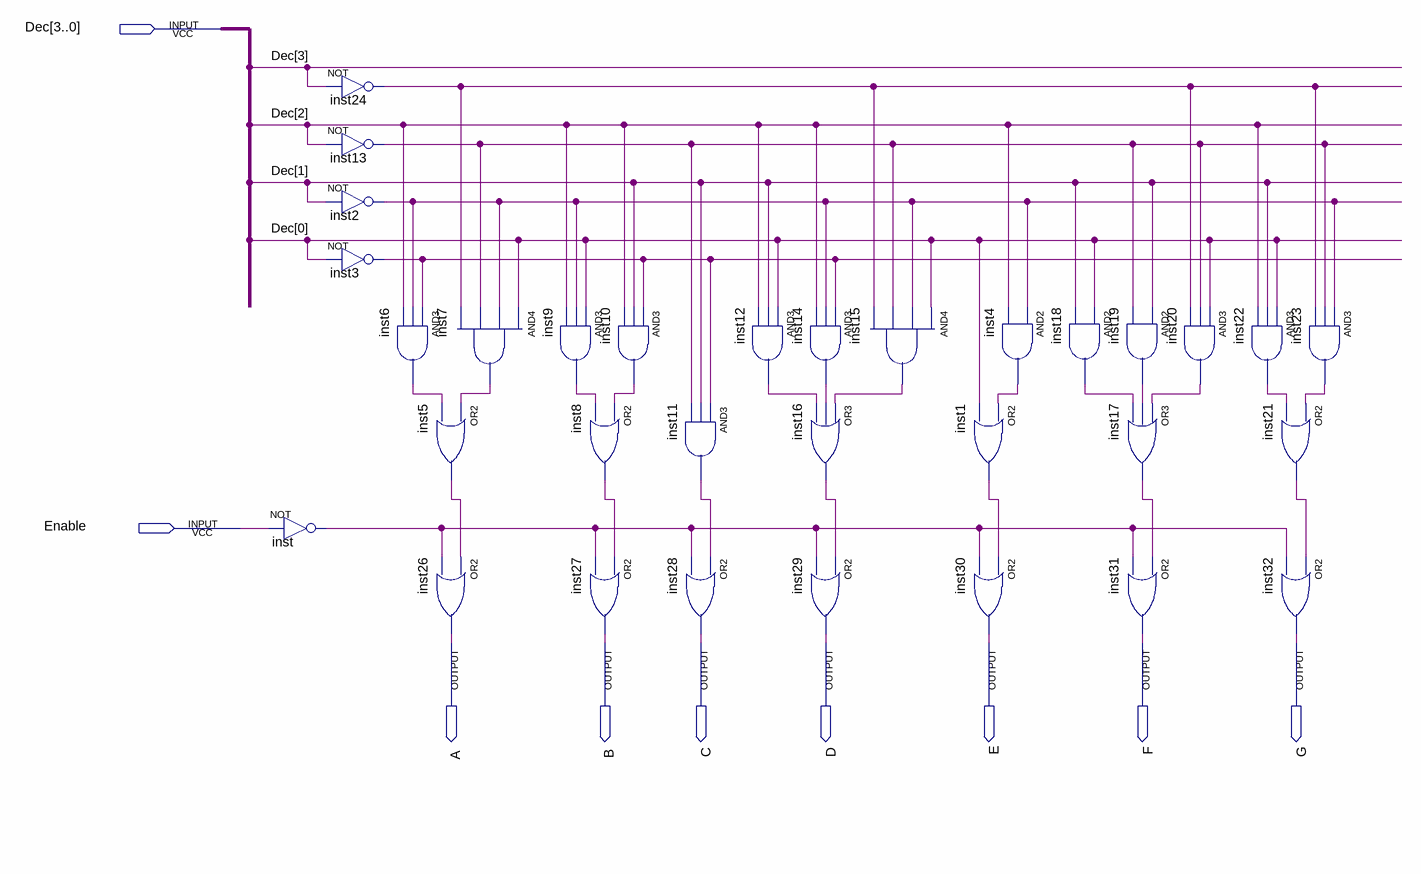
[diagram p0: schematic sheet]
// Quartus schematic Decod_2x.bdf as structural Verilog: 32 symbols, 9 pins
module Decod_2x (
  input  [3:0] Dec,
  input  Enable,
  output A,
  output B,
  output C,
  output D,
  output E,
  output F,
  output G
);

  wire inst1_out, inst2_out, inst3_out, inst4_out, inst5_out, inst6_out, inst7_out, inst8_out, inst9_out,
       inst10_out, inst11_out, inst12_out, inst13_out, inst14_out, inst15_out, inst16_out, inst17_out,
       inst18_out, inst19_out, inst20_out, inst21_out, inst22_out, inst23_out, inst24_out, inst_out;

  not inst (inst_out, Enable);
  not inst24 (inst24_out, Dec[3]);
  not inst13 (inst13_out, Dec[2]);
  not inst2 (inst2_out, Dec[1]);
  not inst3 (inst3_out, Dec[0]);
  and inst6 (inst6_out, inst3_out, inst2_out, Dec[2]);
  and inst7 (inst7_out, Dec[0], inst2_out, inst13_out, inst24_out);
  or inst5 (inst5_out, inst7_out, inst6_out);
  or inst26 (A, inst5_out, inst_out);
  and inst9 (inst9_out, Dec[0], inst2_out, Dec[2]);
  or inst8 (inst8_out, inst10_out, inst9_out);
  or inst27 (B, inst8_out, inst_out);
  and inst10 (inst10_out, inst3_out, Dec[1], Dec[2]);
  and inst11 (inst11_out, inst3_out, Dec[1], inst13_out);
  or inst28 (C, inst11_out, inst_out);
  and inst12 (inst12_out, Dec[0], Dec[1], Dec[2]);
  and inst14 (inst14_out, inst3_out, inst2_out, Dec[2]);
  or inst16 (inst16_out, inst15_out, inst14_out, inst12_out);
  or inst29 (D, inst16_out, inst_out);
  and inst15 (inst15_out, Dec[0], inst2_out, inst13_out, inst24_out);
  or inst1 (inst1_out, inst4_out, Dec[0]);
  or inst30 (E, inst1_out, inst_out);
  and inst4 (inst4_out, inst2_out, Dec[2]);
  and inst18 (inst18_out, Dec[0], Dec[1]);
  and inst19 (inst19_out, Dec[1], inst13_out);
  or inst17 (inst17_out, inst20_out, inst19_out, inst18_out);
  or inst31 (F, inst17_out, inst_out);
  and inst20 (inst20_out, Dec[0], inst13_out, inst24_out);
  and inst22 (inst22_out, Dec[0], Dec[1], Dec[2]);
  or inst21 (inst21_out, inst23_out, inst22_out);
  or inst32 (G, inst21_out, inst_out);
  and inst23 (inst23_out, inst2_out, inst13_out, inst24_out);
endmodule
